# EAGLE design wireless-dong-mk-1.0 (EAGLE 6.5.0)
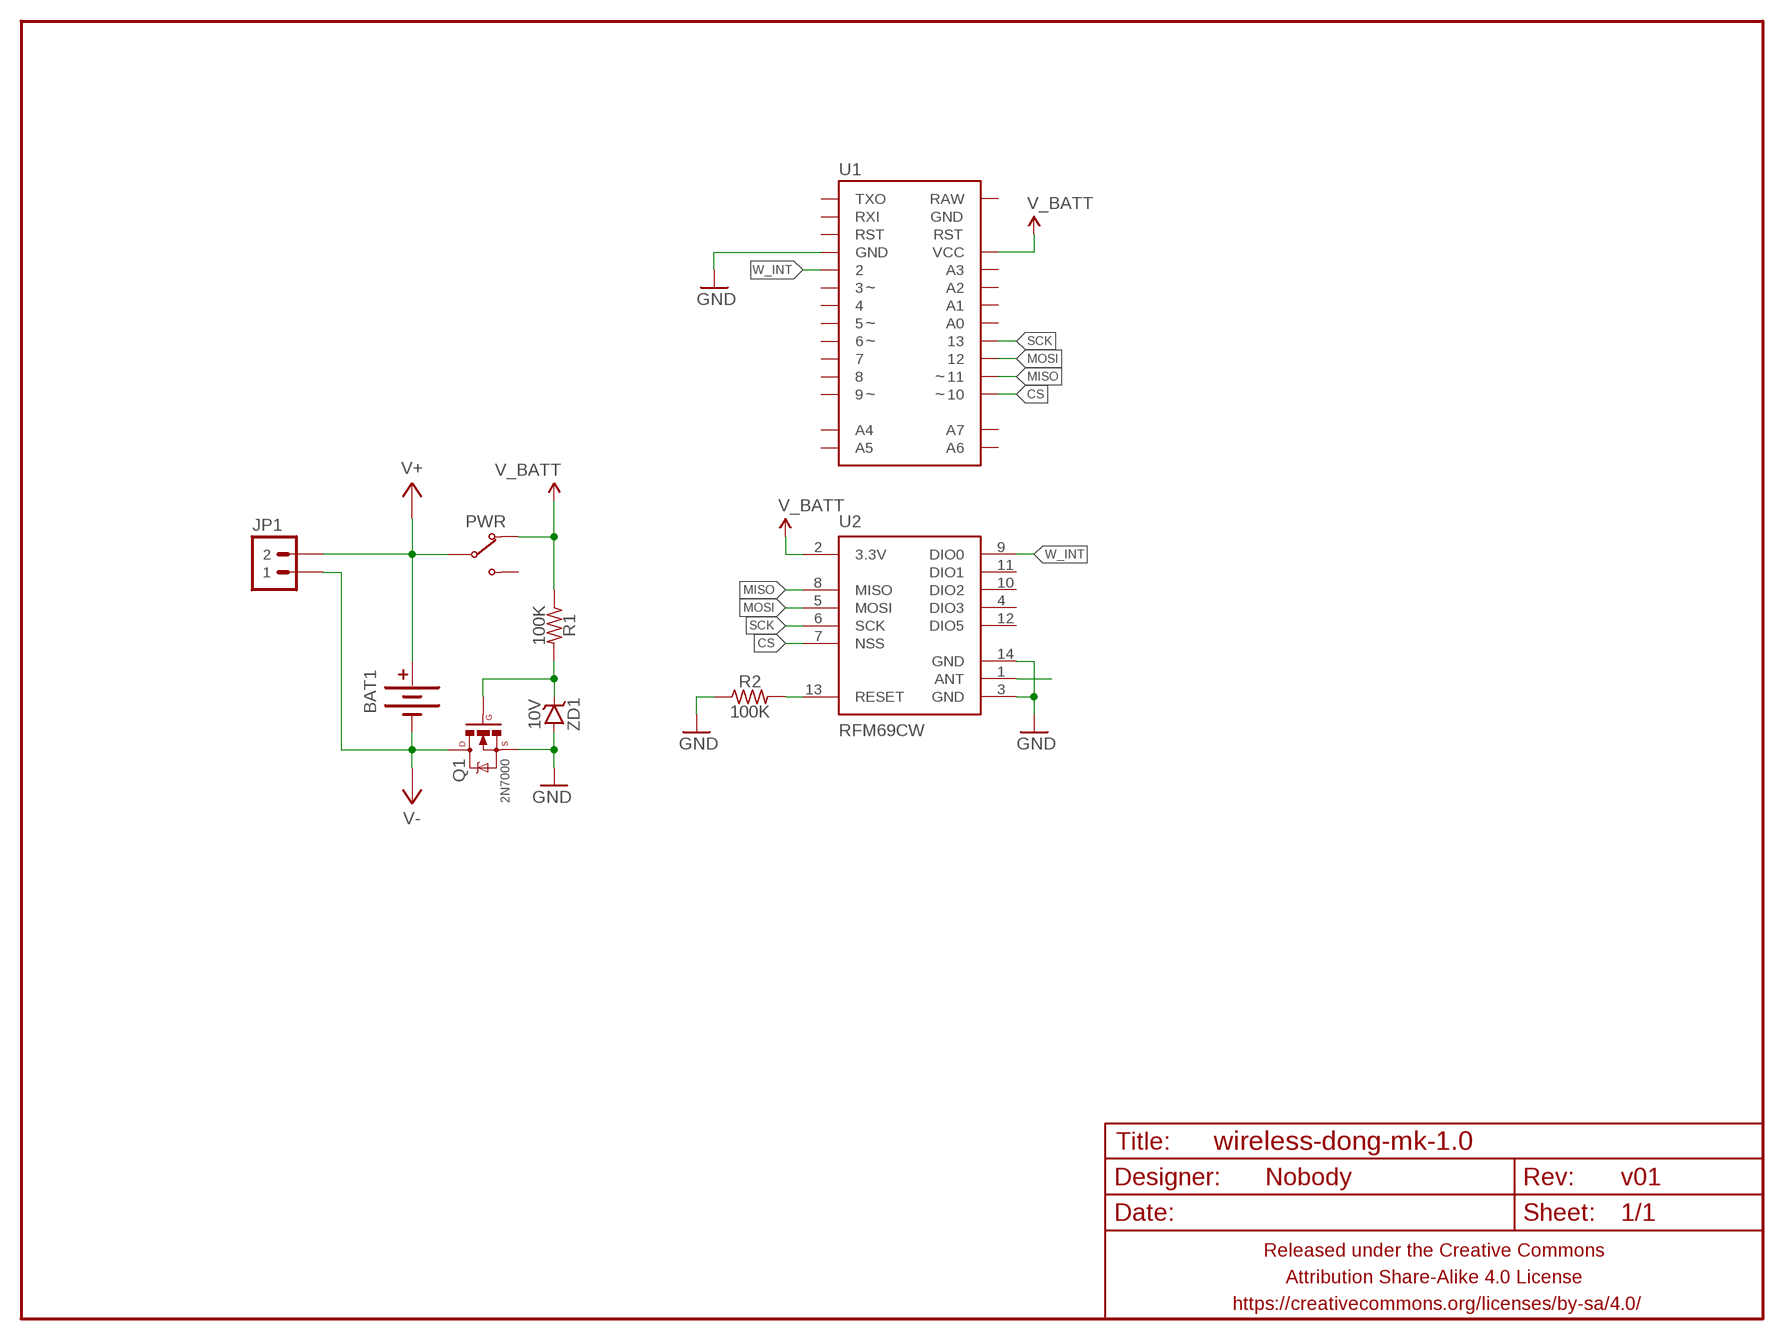
[diagram p0: schematic, sheet 1]

## Parts
BAT1  BATTERYAA  [BATTERY-AA]
FRAME1  FRAME-LETTERNO_PACKAGE  [DUMMY]
JP1  M02PTH-CENTERED-R+  [1X02-CENTER-R+]
PWR  SWITCH-SPDTPTH-RA-2.54MM  [SPDT-RA-2.54MM]
Q1  2N7000  MOSFET-NCHANNELIRLML2502  [SOT23]
R1  100K  RESISTORR0603  [R0603]
R2  100K  RESISTORR0603  [R0603]
U1  ARDUINO-PRO-MINI-NO-FTDIARDUINO_PRO_MINI_NO_FTDI_NO_SILK  [ARDUINO_PRO_MINI_NO_FTDI_NO_SILK]
U2  RFM69CW  [RFM69CW-XXXS2]
ZD1  10V  DIODE-ZENERSOT23  [SOT23]

## Nets
CS: U1.10 U2.7(NSS)
GND: Q1.2(S) R2.1 U1.GND@1(GND) U1.GND@2(GND) U2.3(GND) U2.14(GND) ZD1.1(A) ZD1.2(A)
MISO: U1.11 U2.8(MISO)
MOSI: U1.12 U2.5(MOSI)
N$1: Q1.1(G) R1.2 ZD1.3(C)
N$3: U2.1(ANT)
N$8: R2.2 U2.13(RESET)
SCK: U1.13 U2.6(SCK)
V+: BAT1.PWR@1(+) BAT1.PWR@2(+) JP1.2 PWR.2(COM)
V-: BAT1.GND@1(-) BAT1.GND@2(-) JP1.1 Q1.3(D)
V_BATT: PWR.1(NC) R1.1 U1.VCC U2.2(3.3V)
W_INT: U1.2 U2.9(DIO0)
Unconnected: PWR.3(NO) U1.3 U1.4 U1.5 U1.6 U1.7 U1.8 U1.9 U1.A0 U1.A1 U1.A2 U1.A3 U1.A4 U1.A5 U1.A6 U1.A7 U1.RAW U1.RST@1(RST) U1.RST@2(RST) U1.RX(RXI) U1.TX(TXO) U2.4(DIO3) U2.10(DIO2) U2.11(DIO1) U2.12(DIO5)

## Library data of the parts
BAT1 = A_butts:BATTERY: Battery Holders Various common sizes : AA, AAA, 20mm coin cell and 12mm coin cell. 20MM_4LEGS, BATT-10373
FRAME1 = A_butts:FRAME-LETTER: Schematic Frame Standard 8.5x11 US Letter frame; DESIGNER: Nobody; VERSION: v01
JP1 = A_butts:M02: Standard 2-pin 0.1" header. Use with - straight break away headers ( PRT-00116) - right angle break away headers (PRT-00553) - swiss pins (PRT-00743) - machine pins (PRT-00117) - female headers (PRT-00115) Molex polarized connector foot print use with: PRT-08233 with associated crimp pins and housings. 2.54_SCREWTERM for use with PRT-10571. 3.5mm Screw Terminal footprints for PRT-08084 5mm Screw Terminal footprints for use with PRT-08433
PWR = A_butts:SWITCH-SPDT
Q1 = A_butts:MOSFET-NCHANNEL: Common NMOSFET Parts MFG P/N Store ID Prod ID FDD8780 TRANS-09984 SI7820DN TRANS-11055 FDS6630A IC-08089 2N7002PW TRANS-11151 FQP30N06L COM-10213 TRANS-10060 BSS123LT1G TRANS-08345 BSS138 TRANS-00830 BS170 2N7000
R1 R2 = A_butts:RESISTOR: RESISTOR, American symbol
U1 = A_butts:ARDUINO-PRO-MINI-NO-FTDI
U2 = A_butts:RFM69
ZD1 = A_butts:DIODE-ZENER: Zener Diode Production Part - 8199 3.4V Zener Voltage

## Board
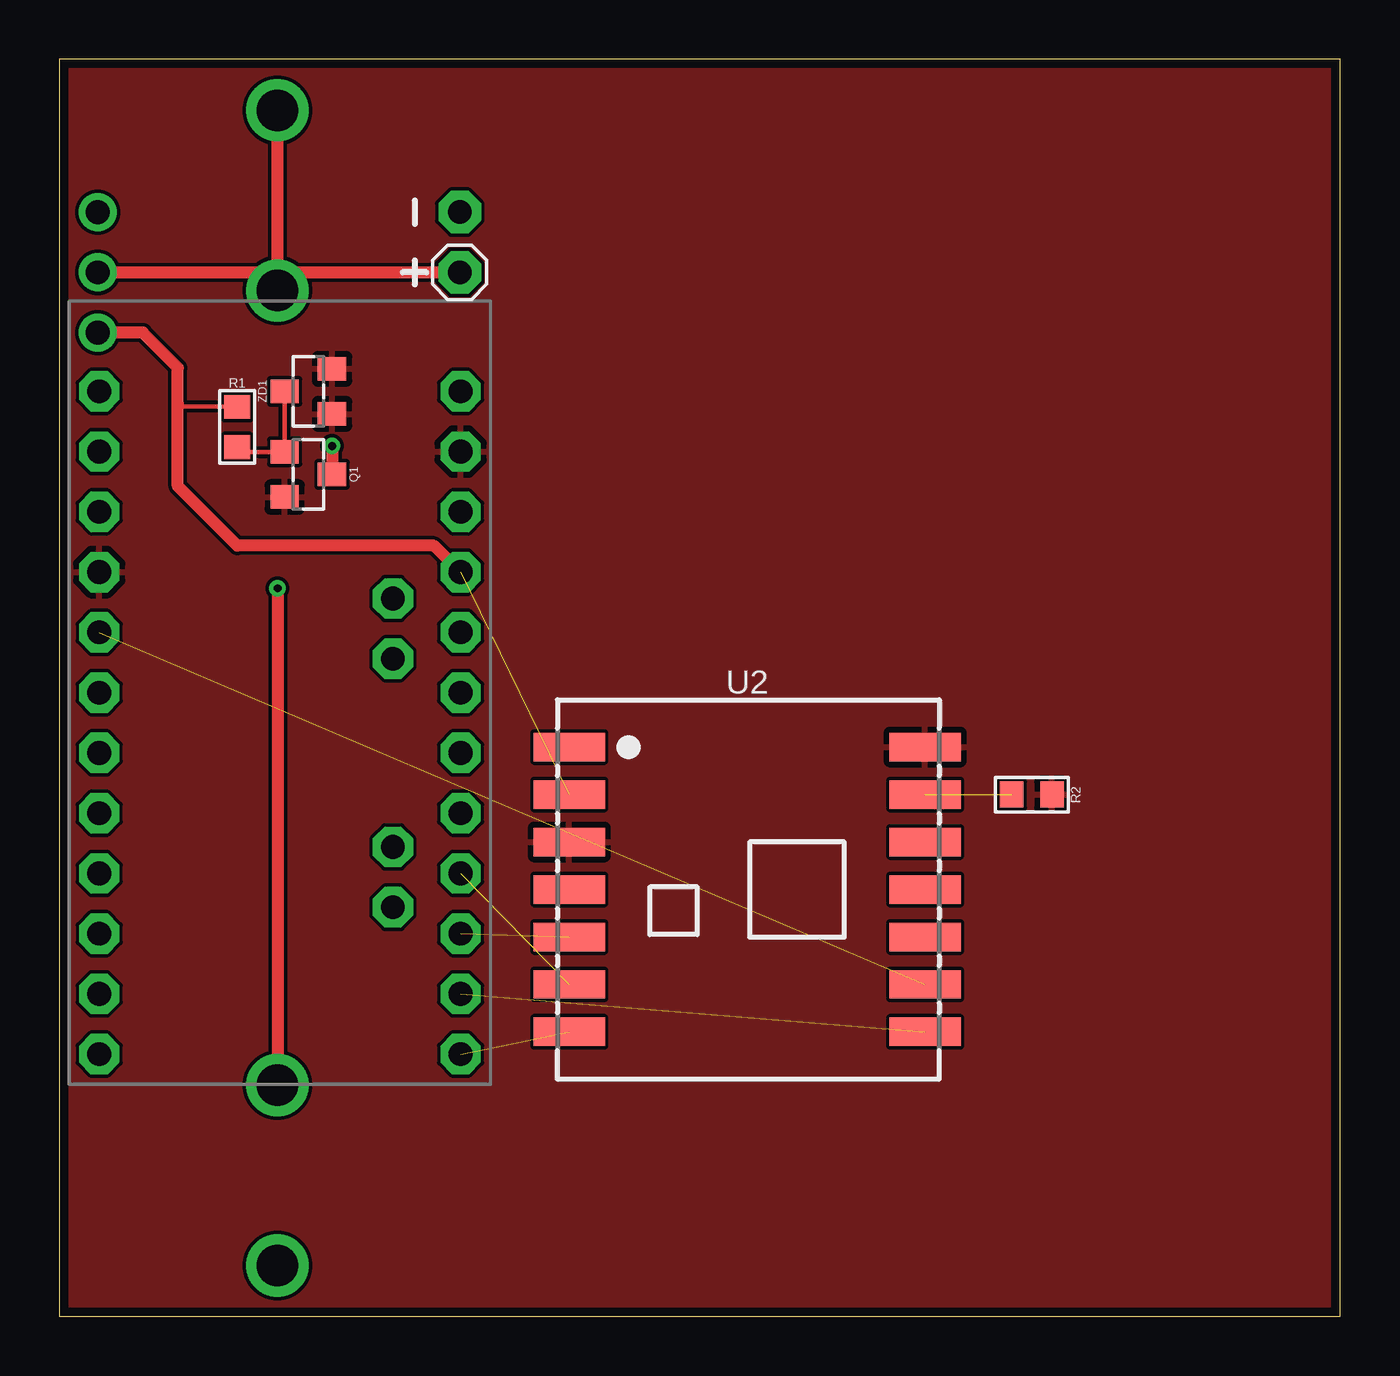
[diagram p1: board, top side]
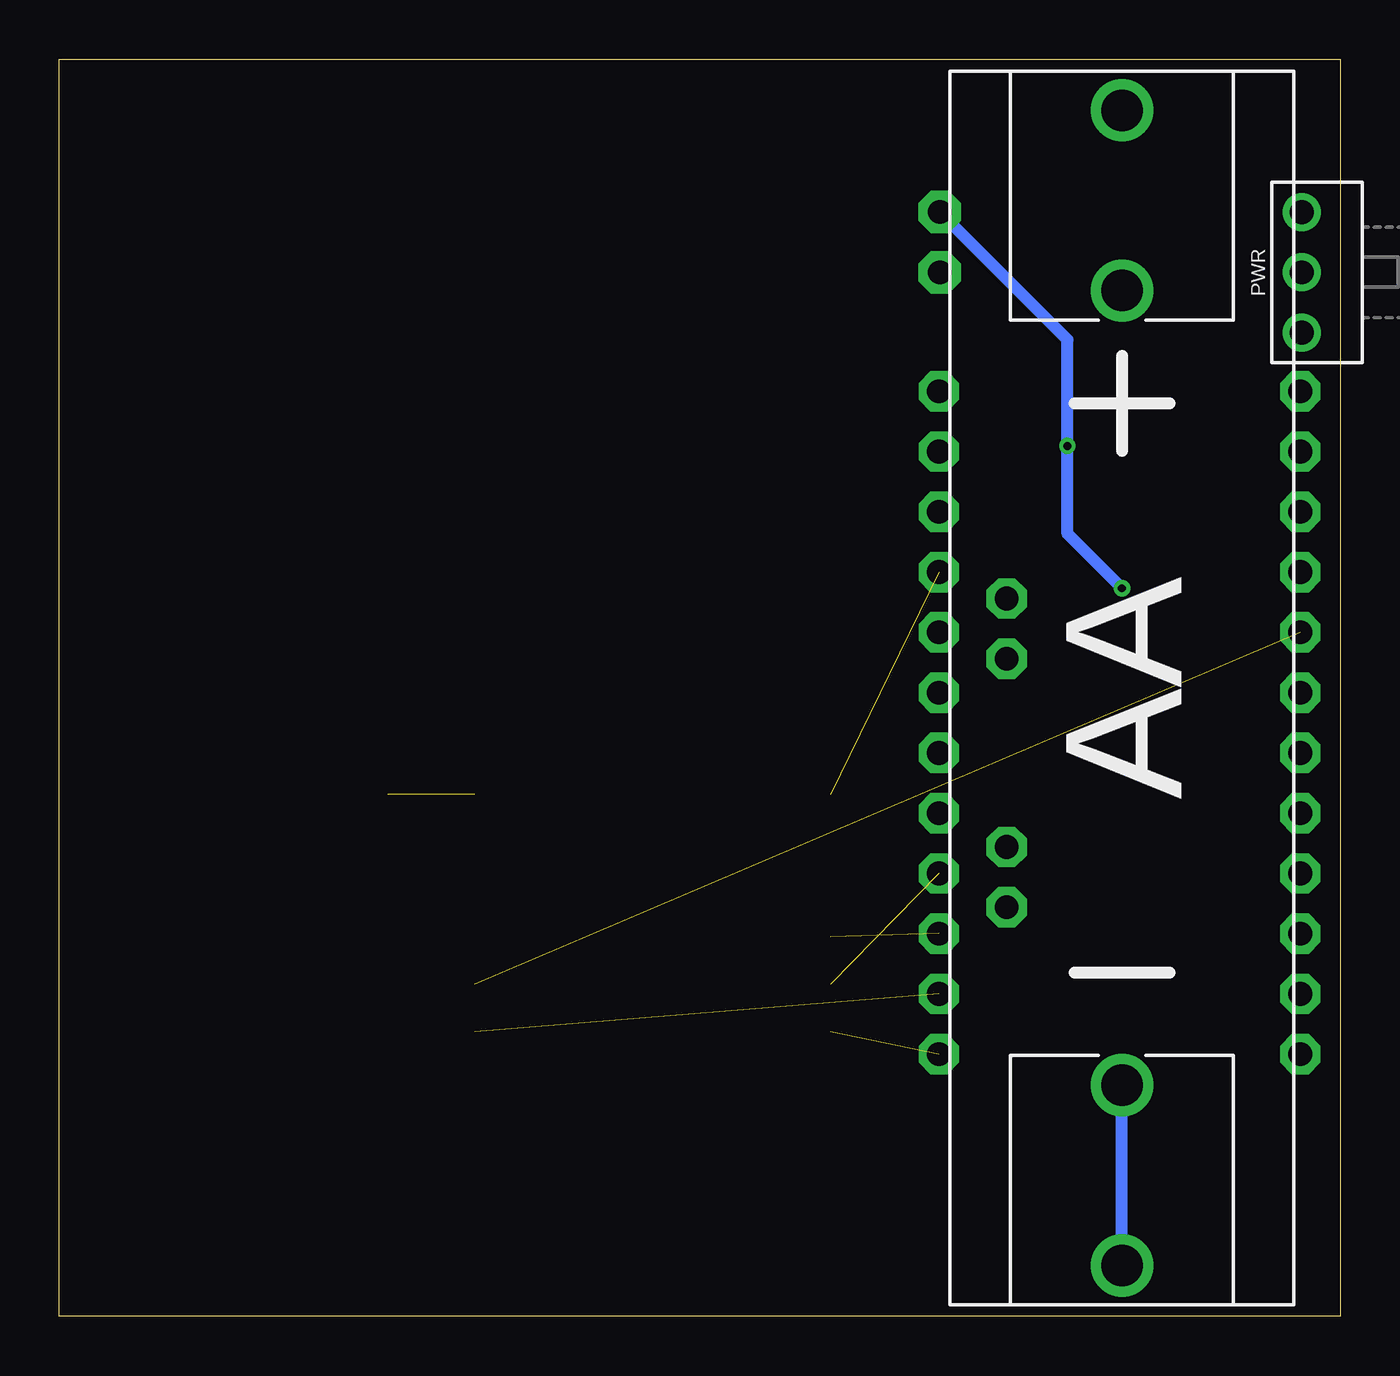
[diagram p2: board, bottom side, seen from below]

Size 54 x 53 mm. Coordinates in mm from the lower left corner, seen from the top.
Outline: 0,0 54,0 54,53 0,53 0,0
Copper layers (1*16): Top 0.0356mm / dielectric 1.5011mm / Bottom 0.0356mm
Design rules "LaenPCBOrder_2": minimum track width 6mil, minimum drill 13mil, track to track 6mil, track to pad 6mil, pad to pad 6mil, via to via 6mil, smd to smd 6mil, copper to edge 15mil, drill to drill 6mil, minimum pad ring 7mil, minimum via ring 7mil, stop-mask expansion 3mil, vias tented up to drill 20mil, thermal gap 10mil

### Footprints (pad centres in the part's own frame; a part is rotated, then mirrored left to right if it is on the bottom)
BATTERY-AA = drill 1.75: GND@1 24.35,0; GND@2 16.75,0; PWR@1 -24.35,0; PWR@2 -16.75,0
1X02-CENTER-R+ = drill 1 pad 1.8 octagon: 1 -1.27,0; 2 1.27,0
SPDT-RA-2.54MM = drill 1 pad 1.6: 1 0,0; 2 2.54,0; 3 5.08,0
SOT23 = smd 1 x 1.2: 1 -0.95,-1; 2 0.95,-1; 3 0,1
R0603 = smd 1 x 1.1: 1 -0.85,0; 2 0.85,0
ARDUINO_PRO_MINI_NO_FTDI_NO_SILK = drill 1 pad 1.7 octagon: 2 -7.62,2.54; 3 -7.62,0; 4 -7.62,-2.54; 5 -7.62,-5.08; 6 -7.62,-7.62; 7 -7.62,-10.16; 8 -7.62,-12.7; 9 -7.62,-15.24; 10 7.62,-15.24; 11 7.62,-12.7; 12 7.62,-10.16; 13 7.62,-7.62; A0 7.62,-5.08; A1 7.62,-2.54; A2 7.62,0; A3 7.62,2.54; A4 4.763,1.429; A5 4.763,3.969; A6 4.763,-9.049; A7 4.763,-6.509; GND@1 -7.62,5.08; GND@2 7.62,10.16; RAW 7.62,12.7; RST@1 -7.62,7.62; RST@2 7.62,7.62; RX -7.62,10.16; TX -7.62,12.7; VCC 7.62,5.08
RFM69CW-XXXS2 = smd 3 x 1.2: 1 -7.5,6; 2 -7.5,4; 3 -7.5,2; 4 -7.5,0; 5 -7.5,-2; 6 -7.5,-4; 7 -7.5,-6; 8 7.5,-6; 9 7.5,-4; 10 7.5,-2; 11 7.5,0; 12 7.5,2; 13 7.5,4; 14 7.5,6

### Placement (x,y rotation side)
BAT1  9.2,26.5 270 bottom
FRAME1  0,0 0 top
JP1  16.88,45.29 270 top
PWR  1.62,41.48 90 bottom
Q1  10.5,35.5 270 top
R1  7.5,37.5 270 top
R2  41,22 180 top
U1  9.3,26.3 0 top
U2  29,18 0 top
ZD1  10.5,39 90 top

### Tracks (layer width: path | path; a pad name or v marks a point on that pad's centre or on a via)
CS  (1 unrouted)
GND
  pour Top: -0.1,-0.1 -0.1,53.1 54.1,53.1 54.1,-0.1
MISO  (1 unrouted)
MOSI  (1 unrouted)
N$1
  Top 0.2: ZD1.3 Q1.1 7.7,36.45 R1.2
N$8  (1 unrouted)
SCK  (1 unrouted)
V+
  Top 0.5: PWR.2 9.2,44.02 | 9.2,44.02 BAT1.PWR@1 | BAT1.PWR@2 9.2,44.02 | 9.2,44.02 JP1.2
V-  (via drill 0.33)
  Top 0.5: v9.2,30.7 BAT1.GND@2 | v11.5,36.7 Q1.3
  Bottom 0.5: BAT1.GND@1 BAT1.GND@2 | JP1.1 11.5,41.18 v11.5,36.7 11.5,33 v9.2,30.7
V_BATT  (1 unrouted)
  Top 0.2: R1.1 5.15,38.35 5,38.5
  Top 0.5: U1.VCC 15.8,32.5 7.5,32.5 5,35 5,38.5 5,40 3.52,41.48 PWR.1
W_INT  (1 unrouted)